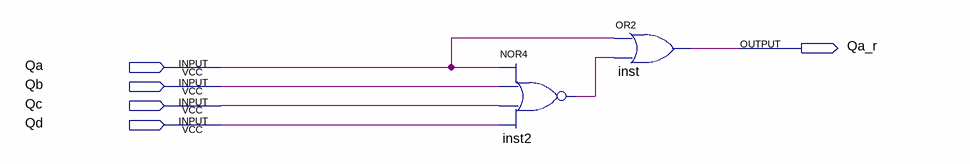
[diagram p0: schematic sheet]
// Quartus schematic all0to1.bdf as structural Verilog: 2 symbols, 5 pins
module all0to1 (
  input  Qa,
  input  Qb,
  input  Qc,
  input  Qd,
  output Qa_r
);

  wire inst2_out;

  nor inst2 (inst2_out, Qa, Qb, Qc, Qd);
  or inst (Qa_r, Qa, inst2_out);
endmodule
